# EAGLE design dimmer (EAGLE 7.5.0)
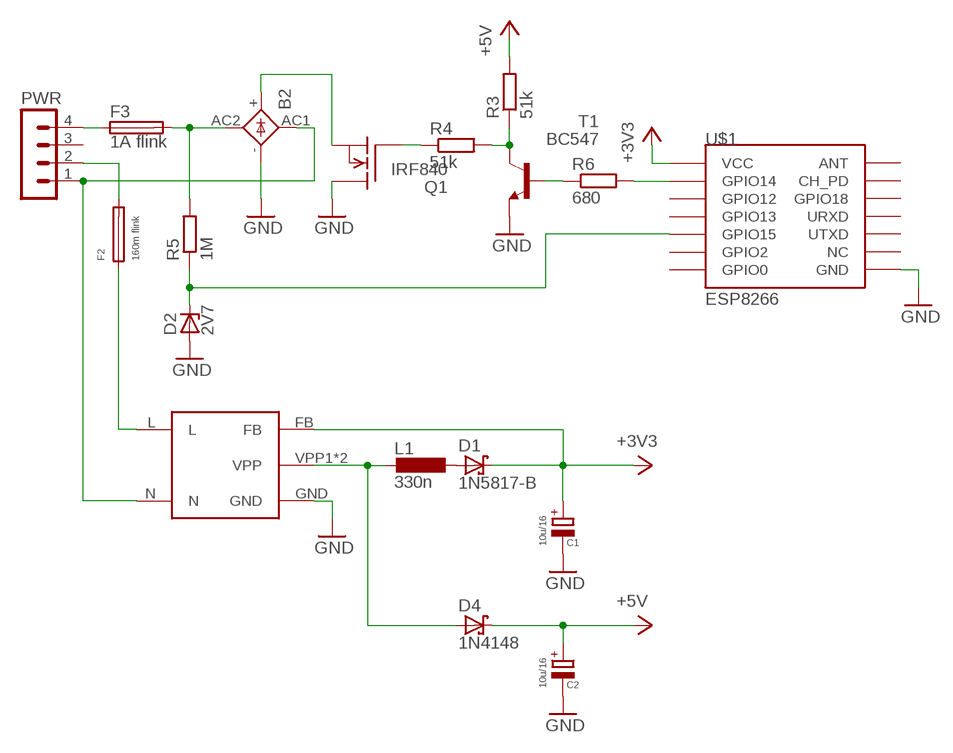
[diagram p0: schematic, sheet 1]

## Parts
B2  2KBP  [2KBP]
C1  10u/16  CPOL-EUE2.5-6  [E2,5-6]
C2  10u/16  CPOL-EUE2.5-6  [E2,5-6]
D1  1N5817-B  [DO41-7.6]
D2  2V7  ZENER-DIODEDO34-7  [DO34Z7]
D4  1N4148  1N5817-B  [DO41-7.6]
F2  160m flink  19560  [19560]
F3  1A flink  FUSESHK20L  [SHK20L]
L1  330n  L-EU0204/5  [0204/5]
PWR  MA04-1  [MA04-1]
Q1  IRF840  [TO220]
R3  51k  R-EU_0207/10  [0207/10]
R4  51k  R-EU_0207/10  [0207/10]
R5  1M  R-EU_0207/12  [0207/12]
R6  680  R-EU_0207/10  [0207/10]
T1  BC547  [TO92]
U$1  ESP8266  [ESP-03]
U$2  SMPS  [SMPS]

## Nets
+3V3: C1.+ D1.C U$1.VCC U$2.FB
+5V: C2.+ D4.C R3.2
GND: B2.- C1.- C2.- D2.A Q1.2(D) T1.1(E) U$1.GND U$2.GND
N$1: Q1.1(G) R4.1
N$2: R3.1 R4.2 T1.3(C)
N$3: D1.A L1.1
N$4: B2.AC1 PWR.1 U$2.N
N$5: R6.1 T1.2(B)
N$6: D4.A L1.2 U$2.VPP1(VPP) U$2.VPP2(VPP)
N$7: D2.C R5.1 U$1.GPIO15
N$8: F2.2 PWR.2
N$9: F2.1 U$2.L
N$12: R6.2 U$1.GPIO14
N$17: B2.AC2 F3.2A R5.2
N$21: B2.+ Q1.3(S)
N$31: F3.1A PWR.4
Unconnected: PWR.3 U$1.ANT U$1.CH_PD U$1.GPIO0 U$1.GPIO2 U$1.GPIO12 U$1.GPIO13 U$1.GPIO18 U$1.NC U$1.URXD U$1.UTXD

## Library data of the parts
B2 = rectifier:2KBP: RECTIFIER grid 3 x 3,81 mm
C1 C2 = rcl:CPOL-EU: POLARIZED CAPACITOR, European symbol
D1 D4 = diode:1N581*: 1.0A SCHOTTKY BARRIER RECTIFIER Source: http://www.diodes.com/datasheets/ds23001.pdf
D2 = diode:ZENER-DIODE: Z-Diode
F2 = fuse:19560: FUSE HOLDER TR5, Wickmann; MPN: 56000001009; OC_FARNELL: 1185363; OC_NEWARK: 15P8392
F3 = fuse:FUSE: Fuse; OC_FARNELL: unknown; OC_NEWARK: unknown
L1 = rcl:L-EU: INDUCTOR, European symbol
PWR = con-lstb:MA04-1: PIN HEADER; OC_FARNELL: unknown; OC_NEWARK: unknown
Q1 = transistor-fet:IRF840: N-Channel Enhancement MOSFET (HEXFET); 500V; 8A; 0,85Ohm
R3-R6 = rcl:R-EU_: RESISTOR, European symbol
T1 = transistor:BC547: NPN TRANSISTOR
U$1 = esp8266modules:ESP8266: ESP8266 Wifi module 03 & 04
U$2 = smps:SMPS

## Board
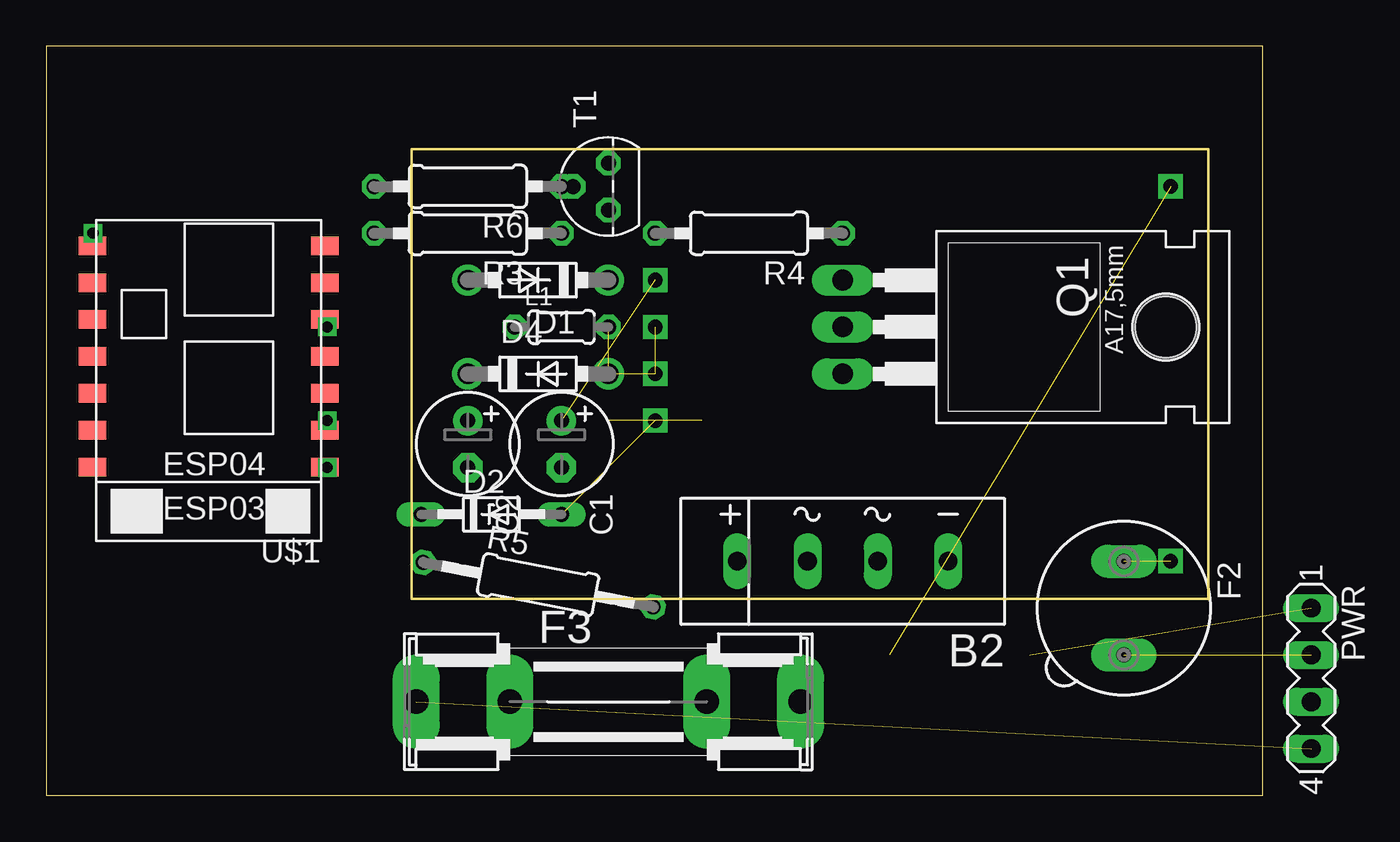
[diagram p1: board, top side]
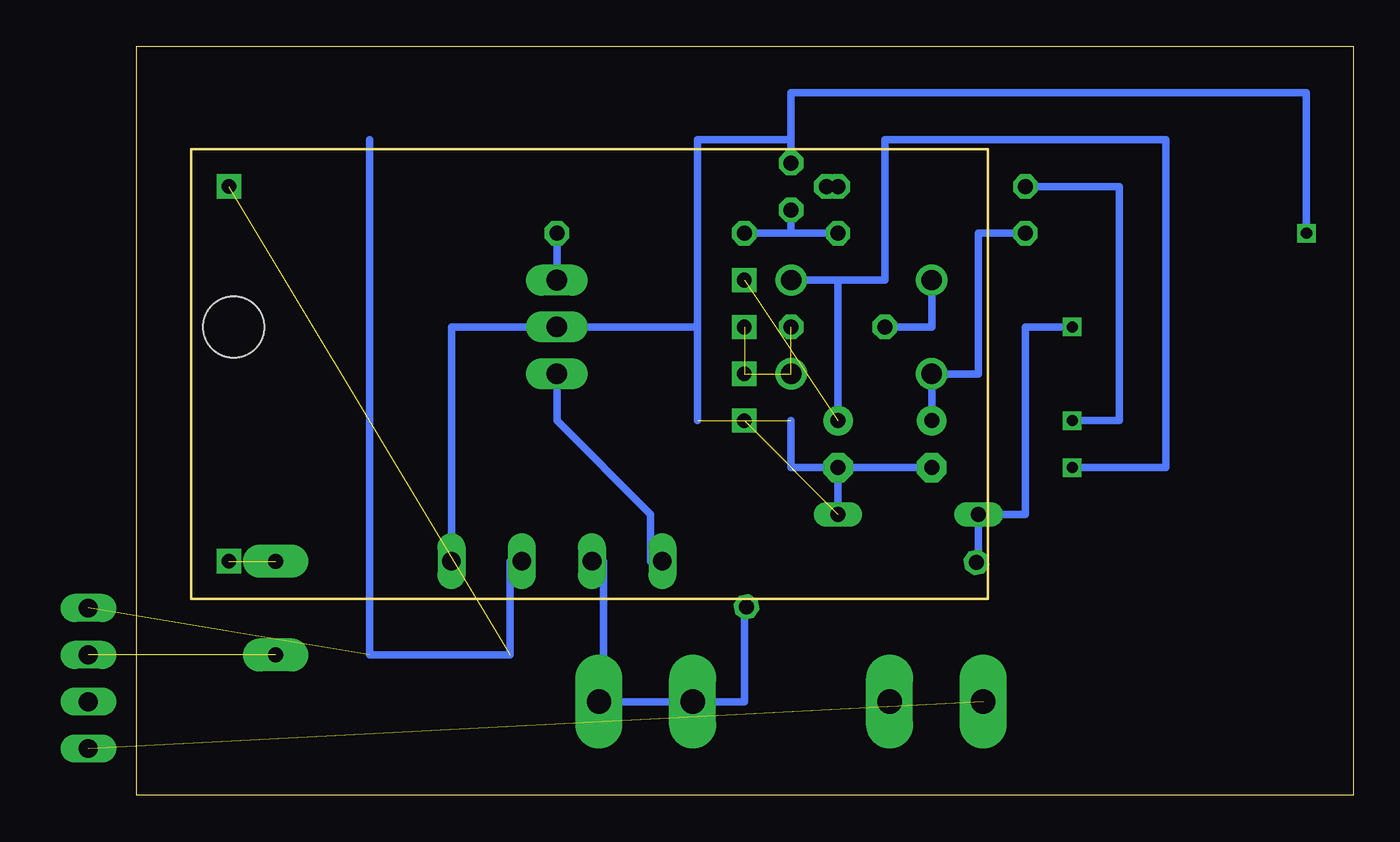
[diagram p2: board, bottom side, seen from below]

Size 65.96 x 40.63 mm. Coordinates in mm from the lower left corner, seen from the top.
Outline: 0,0 65.96,0 65.96,40.63 0,40.63 0,0
Copper layers (1*16): Top 0.035mm / dielectric 1.5mm / Bottom 0.035mm
Design rules "default": minimum track width 10mil, minimum drill 24mil, track to track 8mil, track to pad 8mil, pad to pad 8mil, via to via 8mil, smd to smd 8mil, copper to edge 40mil, drill to drill 8mil, minimum pad ring 10mil, minimum via ring 8mil, stop-mask expansion 4mil, vias tented up to drill 0mil, thermal gap 10mil

### Footprints (pad centres in the part's own frame; a part is rotated, then mirrored left to right if it is on the bottom)
2KBP = drill 1.016 long: + 5.715,0; - -5.715,0; AC1 -1.905,0; AC2 1.905,0
E2,5-6 = drill 0.813 pad 1.6: + -1.27,0 | drill 0.813 pad 1.6 octagon: - 1.27,0
DO41-7.6 = drill 1.1 pad 1.7: A 3.81,0; C -3.81,0
DO34Z7 = drill 0.813 long: A 3.81,0; C -3.81,0
19560 = drill 0.813 pad 1.778 long: 1 -2.54,0; 2 2.54,0
SHK20L = drill 1.321 pad 2.54 long: 1A -10.414,0; 1B -5.334,0; 2A 10.414,0; 2B 5.334,0
0204/5 = drill 0.813 octagon: 1 -2.54,0; 2 2.54,0
MA04-1 = drill 1.016 long: 1 -3.81,0; 2 -1.27,0; 3 1.27,0; 4 3.81,0
TO220 = drill 1.118 long: 1 -2.54,-6.35; 2 0,-6.35; 3 2.54,-6.35 | hole 3.302: 0,11.176
0207/10 = drill 0.813 octagon: 1 -5.08,0; 2 5.08,0
0207/12 = drill 0.813 octagon: 1 -6.35,0; 2 6.35,0
TO92 = drill 0.813 octagon: 1 1.27,0; 2 0,1.905; 3 -1.27,0
ESP-03 = smd 1.5 x 1: ANT 7.4,4.8; CH_PD 7.4,2.8; GND 7.4,-7.2; GPIO0 -5.2,-7.2; GPIO2 -5.2,-5.2; GPIO12 -5.2,0.8; GPIO13 -5.2,-1.2; GPIO14 -5.2,2.8; GPIO15 -5.2,-3.2; GPIO18 7.4,0.8; NC 7.4,-5.2; URXD 7.4,-1.2; UTXD 7.4,-3.2; VCC -5.2,4.8
SMPS = drill 0.8 square: FB 7.62,-5.08; GND 7.62,2.54; L -20.32,10.16; N -20.32,-10.16; VPP1 7.62,0; VPP2 7.62,-2.54

### Placement (x,y rotation side)
B2  43.18,12.7 180 top
C1  27.94,19.05 270 top
C2  22.86,19.05 270 top
D1  26.67,27.94 180 top
D2  24.13,15.24 0 top
D4  26.67,22.86 0 top
F2  58.42,10.16 270 top
F3  30.48,5.08 0 top
L1  27.94,25.4 0 top
PWR  68.58,6.35 270 top
Q1  49.53,25.4 270 top
R3  22.86,30.48 180 top
R4  38.1,30.48 180 top
R5  26.67,11.43 349 top
R6  22.86,33.02 180 top
T1  30.48,33.02 90 top
U$1  9.91,22.61 180 top
U$2  40.64,22.86 180 top

### Tracks (layer width: path | path; a pad name or v marks a point on that pad's centre or on a via)
+3V3  (via drill 0.6)  (1 unrouted)
  Top 0.406: U$1.VCC 15.11,17.78 v15.24,17.78
  Bottom 0.406: C1.+ 27.94,27.94 | 27.94,27.94 D1.C | v15.24,17.78 10.16,17.78 10.16,35.56 25.4,35.56 25.4,27.94 27.94,27.94
+5V
  Bottom 0.406: C2.+ D4.C 20.32,22.86 20.32,30.48 R3.2
GND  (via drill 0.6)  (2 unrouted)
  Top 0.406: U$1.GND 2.51,30.48 v2.54,30.48
  Bottom 0.406: C2.- C1.- | C1.- 30.48,17.78 30.48,20.32 | 35.56,20.32 35.56,25.4 | 35.56,25.4 Q1.2 48.9,25.4 B2.- | 35.56,25.4 35.56,35.56 30.48,35.56 | 30.48,35.56 30.48,38.1 2.54,38.1 v2.54,30.48 | 30.48,35.56 T1.1 | D2.A C1.-
N$1
  Bottom 0.406: Q1.1 R4.1
N$2
  Bottom 0.406: R4.2 30.48,30.48 | 30.48,30.48 R3.1 | T1.3 30.48,30.48
N$3
  Bottom 0.406: L1.1 22.86,25.4 D1.A
N$4  (2 unrouted)
  Bottom 0.406: 53.34,35.56 53.34,7.62 45.72,7.62 45.72,12.7 B2.AC1
N$5
  Bottom 0.406: R6.1 T1.2
N$6  (3 unrouted)
N$7  (via drill 0.6)
  Top 0.406: v15.24,25.4 15.24,25.81 U$1.GPIO15
  Bottom 0.406: R5.1 20.32,12.64 D2.C 17.78,15.24 17.78,25.4 v15.24,25.4
N$8  (1 unrouted)
N$9  (1 unrouted)
N$12  (via drill 0.6)
  Top 0.406: v15.24,20.32 15.24,19.81 U$1.GPIO14
  Bottom 0.406: R6.2 12.7,33.02 12.7,20.32 v15.24,20.32
N$17
  Bottom 0.406: B2.AC2 40.64,12.7 40.64,5.08 F3.2A 33.02,5.08 33.02,10.22 R5.2
N$21
  Bottom 0.406: B2.+ 38.1,12.7 38.1,15.24 43.18,20.32 Q1.3
N$31  (1 unrouted)